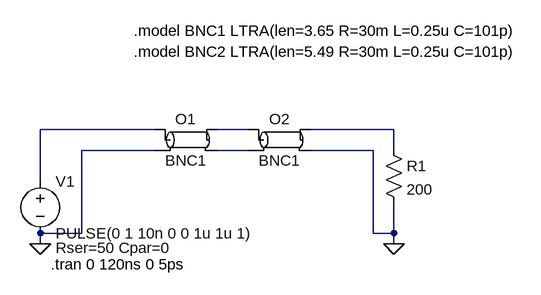
[diagram p0: schematic p1.lossy.asc]
p1.lossy.asc, the LTspice schematic file:
Version 4
SHEET 1 1192 680
WIRE 208 224 32 224
WIRE 352 224 304 224
WIRE 576 224 448 224
WIRE 208 256 96 256
WIRE 352 256 304 256
WIRE 544 256 448 256
WIRE 576 256 576 224
WIRE 32 304 32 224
WIRE 96 384 96 256
WIRE 96 384 32 384
WIRE 544 384 544 256
WIRE 576 384 576 336
WIRE 576 384 544 384
WIRE 32 400 32 384
WIRE 576 400 576 384
FLAG 32 400 0
FLAG 576 400 0
SYMBOL Voltage 32 288 R0
WINDOW 39 24 118 Left 2
SYMATTR SpiceLine Rser=50 Cpar=0
SYMATTR InstName V1
SYMATTR Value PULSE(0 1 10n 0 0 1u 1u 1)
SYMBOL Res 560 240 R0
SYMATTR InstName R1
SYMATTR Value 200
SYMBOL ltline 256 240 R0
SYMATTR InstName O1
SYMATTR Value BNC1
SYMBOL ltline 400 240 R0
SYMATTR InstName O2
SYMATTR Value BNC1
TEXT 48 432 Left 2 !.tran 0 120ns 0 5ps
TEXT 176 72 Left 2 !.model BNC1 LTRA(len=3.65 R=30m L=0.25u C=101p)
TEXT 176 104 Left 2 !.model BNC2 LTRA(len=5.49 R=30m L=0.25u C=101p)

The netlist it stands for:
* p1.lossy.asc
V1 N001 0 PULSE(0 1 10n 0 0 1u 1u 1) Rser=50 Cpar=0
R1 N003 0 200
O1 N001 0 N002 N004 BNC1
O2 N002 N004 N003 0 BNC1
.tran 0 120ns 0 5ps
.model BNC1 LTRA(len=3.65 R=30m L=0.25u C=101p)
.model BNC2 LTRA(len=5.49 R=30m L=0.25u C=101p)
.backanno
.end